# EAGLE design rct_cntrl_brd (EAGLE 8.0.0)
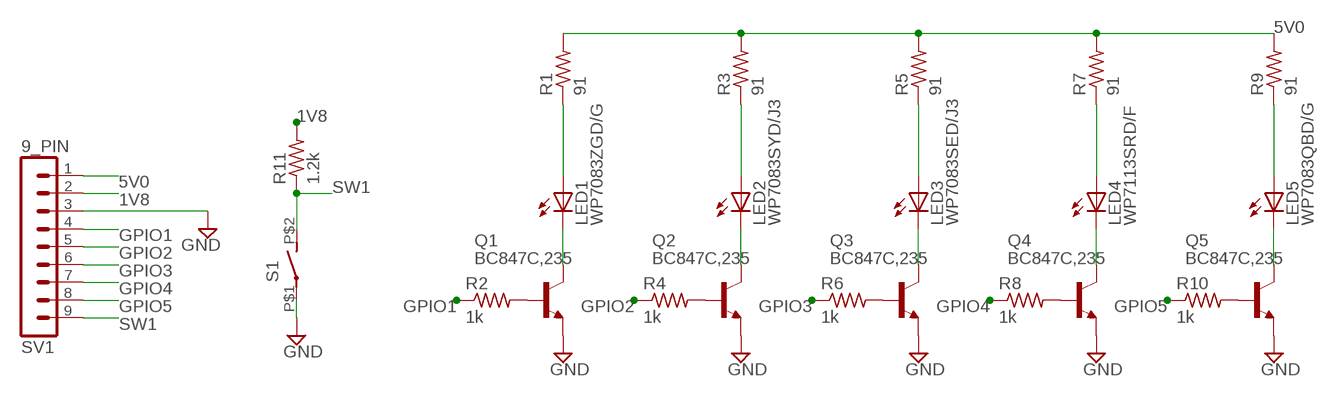
[diagram p0: schematic, sheet 1]

## Parts
LED1  WP7083ZGD/G  LED5MM  [LED5MM]
LED2  WP7083SYD/J3  LED5MM  [LED5MM]
LED3  WP7083SED/J3  LED5MM  [LED5MM]
LED4  WP7113SRD/F  LED5MM  [LED5MM]
LED5  WP7083QBD/G  LED5MM  [LED5MM]
Q1  BC847C,235  BC847C-NPN-SOT23-BEC  [SOT23-BEC]
Q2  BC847C,235  BC847C-NPN-SOT23-BEC  [SOT23-BEC]
Q3  BC847C,235  BC847C-NPN-SOT23-BEC  [SOT23-BEC]
Q4  BC847C,235  BC847C-NPN-SOT23-BEC  [SOT23-BEC]
Q5  BC847C,235  BC847C-NPN-SOT23-BEC  [SOT23-BEC]
R1  91  R-US_R0603  [R0603]
R2  1k  R-US_R0603  [R0603]
R3  91  R-US_R0603  [R0603]
R4  1k  R-US_R0603  [R0603]
R5  91  R-US_R0603  [R0603]
R6  1k  R-US_R0603  [R0603]
R7  91  R-US_R0603  [R0603]
R8  1k  R-US_R0603  [R0603]
R9  91  R-US_R0603  [R0603]
R10  1k  R-US_R0603  [R0603]
R11  1.2k  R-US_R0603  [R0603]
S1  TMS6T5B2M2RE  [PC_THRU_HOLE_2]
SV1  9_PIN  MA09-1  [MA09-1]

## Nets
1V8: R11.2 SV1.2
5V0: R1.2 R3.2 R5.2 R7.2 R9.2 SV1.1
GND: Q1.E Q2.E Q3.E Q4.E Q5.E S1.P$1(P) SV1.3
GPIO1: R2.1 SV1.4
GPIO2: R4.1 SV1.5
GPIO3: R6.1 SV1.6
GPIO4: R8.1 SV1.7
GPIO5: R10.1 SV1.8
N$1: LED3.K(C) Q3.C
N$2: LED1.A R1.1
N$3: LED1.K(C) Q1.C
N$4: Q1.B R2.2
N$5: LED2.A R3.1
N$6: LED2.K(C) Q2.C
N$7: Q2.B R4.2
N$8: LED3.A R5.1
N$9: Q3.B R6.2
N$10: LED4.A R7.1
N$11: LED4.K(C) Q4.C
N$12: Q4.B R8.2
N$13: LED5.A R9.1
N$14: LED5.K(C) Q5.C
N$15: Q5.B R10.2
SW1: R11.1 S1.P$2(S) SV1.9

## Library data of the parts
LED1-LED5 = led:LED: LED OSRAM: - CHIPLED LG R971, LG N971, LY N971, LG Q971, LY Q971, LO R971, LY R971 LH N974, LH R974 LS Q976, LO Q976, LY Q976 LO Q996 - Hyper CHIPLED LW Q18S LB Q993, LB Q99A, LB R99A - SideLED LS A670, LO A670, LY A670, LG A670, LP A670 LB A673, LV A673, LT A673, LW A673 LH A674 LY A675 LS A676, LA A676, LO A676, LY A676, LW A676 LS A679, LY A679, LG A679 - Hyper Micro SIDELED® LS Y876, LA Y876, LO Y876, LY Y876 LT Y87S - SmartLED LW L88C, LW L88S LB L89C, LB L89S, LG L890 LS L89K, LO L89K, LY L89K LS L896, LA L896, LO L896, LY L896 - TOPLED LS T670, LO T670, LY T670, LG T670, LP T670 LSG T670, LSP T670, LSY T670, LOP T670, LYG T670 LG T671, LOG T671, LSG T671 LB T673, LV T673, LT T673, LW T673 LH T674 LS T676, LA T676, LO T676, LY T676, LB T676, LH T676, LSB T676, LW T676 LB T67C, LV T67C, LT T67C, LS T67K, LO T67K, LY T67K, LW E67C LS E67B, LA E67B, LO E67B, LY E67B, LB E67C, LV E67C, LT E67C LW T67C LS T679, LY T679, LG T679 LS T770, LO T770, LY T770, LG T770, LP T770 LB T773, LV T773, LT T773, LW T773 LH T774 LS E675, LA E675, LY E675, LS T675 LS T776, LA T776, LO T776, LY T776, LB T776 LHGB T686 LT T68C, LB T68C - Hyper Mini TOPLED® LB M676 - Mini TOPLED Santana® LG M470 LS M47K, LO M47K, LY M47K Source: http://www.osram.convergy.de LUXEON: - LUMILED® LXK2-PW12-R00, LXK2-PW12-S00, LXK2-PW14-U00, LXK2-PW14-V00 LXK2-PM12-R00, LXK2-PM12-S00, LXK2-PM14-U00 LXK2-PE12-Q00, LXK2-PE12-R00, LXK2-PE12-S00, LXK2-PE14-T00, LXK2-PE14-U00 LXK2-PB12-K00, LXK2-PB12-L00, LXK2-PB12-M00, LXK2-PB14-N00, LXK2-PB14-P00, LXK2-PB14-Q00 LXK2-PR12-L00, LXK2-PR12-M00, LXK2-PR14-Q00, LXK2-PR14-R00 LXK2-PD12-Q00, LXK2-PD12-R00, LXK2-PD12-S00 LXK2-PH12-R00, LXK2-PH12-S00 LXK2-PL12-P00, LXK2-PL12-Q00, LXK2-PL12-R00 Source: www.luxeon.com KINGBRIGHT: KA-3528ASYC Source: www.kingbright.com
Q1-Q5 = transistor:*-NPN-: NPN Transistror BF959 corrected 2008.03.06
R1-R11 = rcl:R-US_: RESISTOR, American symbol
S1 = rct_cntrl_brd:TMS6T5B2M2RE
SV1 = con-lstb:MA09-1: PIN HEADER; OC_FARNELL: unknown; OC_NEWARK: unknown

## Board
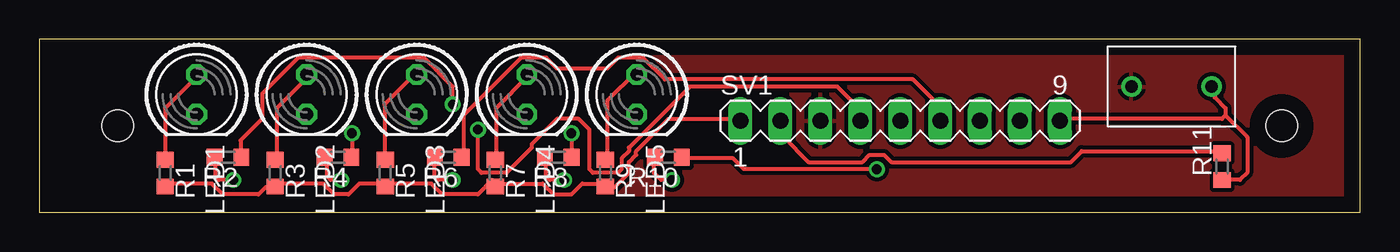
[diagram p1: board, top side]
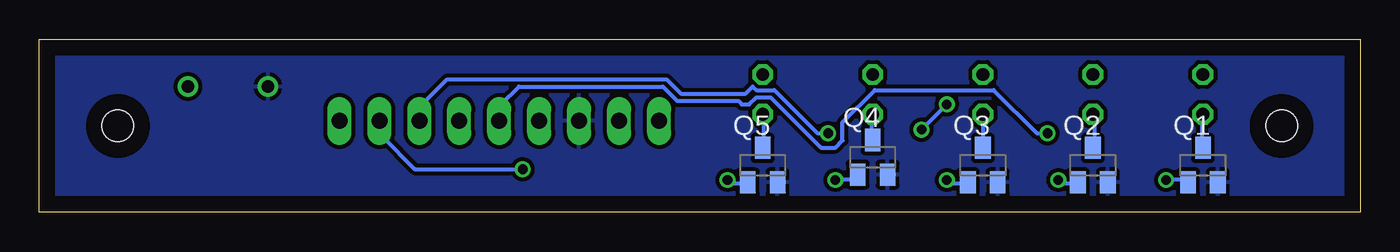
[diagram p2: board, bottom side, seen from below]

Size 84 x 11 mm. Coordinates in mm from the lower left corner, seen from the top.
Outline: 0,0 84,0 84,11 0,11 0,0
Copper layers (1*16): Top 0.035mm / dielectric 1.5mm / Bottom 0.035mm
Design rules "default": minimum track width 10mil, minimum drill 24mil, track to track 8mil, track to pad 8mil, pad to pad 8mil, via to via 8mil, smd to smd 8mil, copper to edge 40mil, drill to drill 8mil, minimum pad ring 10mil, minimum via ring 8mil, stop-mask expansion 4mil, vias tented up to drill 0mil, thermal gap 10mil
Holes 2 mm at 5,5.5 79,5.5

### Footprints (pad centres in the part's own frame; a part is rotated, then mirrored left to right if it is on the bottom)
LED5MM = drill 0.813 octagon: A -1.27,0; K 1.27,0
SOT23-BEC = smd 1 x 1.4: B -0.95,-1.1; C 0,1.1; E 0.95,-1.1
R0603 = smd 1 x 1.1: 1 -0.85,0; 2 0.85,0
PC_THRU_HOLE_2 = drill 0.8: P$1 0,2.54; P$2 0,-2.54
MA09-1 = drill 1.016 long: 1 -10.16,0; 2 -7.62,0; 3 -5.08,0; 4 -2.54,0; 5 0,0; 6 2.54,0; 7 5.08,0; 8 7.62,0; 9 10.16,0

### Placement (x,y rotation side)
LED1  10,7.5 270 top
LED2  17,7.5 270 top
LED3  24,7.5 270 top
LED4  31,7.5 270 top
LED5  38,7.5 270 top
Q1  10,3 0 bottom
Q2  17,3 0 bottom
Q3  24,3 0 bottom
Q4  31,3.5 0 bottom
Q5  38,3 0 bottom
R1  8,2.5 270 top
R2  12,3.5 180 top
R3  15,2.5 270 top
R4  19,3.5 180 top
R5  22,2.5 270 top
R6  26,3.5 180 top
R7  29,2.5 270 top
R8  33,3.5 180 top
R9  36,2.5 270 top
R10  40,3.5 180 top
R11  75.21,2.91 90 top
S1  72,8 90 top
SV1  54.75,5.81 0 top

### Tracks (layer width: path | path; a pad name or v marks a point on that pad's centre or on a via)
1V8
  Top 0.254: R11.2 75.21,3.89 66.29,3.89 65.61,3.2 54.18,3.2 53.72,3.66 52.81,3.66 52.35,3.2 48.92,3.2 47.32,4.8 47.32,5.71 SV1.2
5V0
  Top 0.254: R1.2 8,1.83 10.97,1.83 11.66,1.14 13.95,1.14 14.4,1.6 14.86,1.6 R3.2 15.09,1.83 18.06,1.83 18.75,1.14 19.66,1.14 20.34,1.83 21.95,1.83 R5.2 22.17,1.83 24.92,1.83 25.6,1.14 27.89,1.14 28.8,2.06 29.03,1.83 | 29.03,1.83 32,1.83 32.69,1.14 33.83,1.14 34.52,1.83 35.89,1.83 R9.2 36.12,1.6 36.58,1.6 37.49,2.52 37.49,3.2 37.95,3.66 37.95,3.89 40.01,5.94 44.58,5.94 SV1.1 | 29.03,1.83 R7.2
GND
  pour Bottom (isolate 0.254): 0.5,10.5 83.5,10.5 83.5,0.5 0.5,0.5
  pour Top (isolate 0.254): 0.5,10.5 83.5,10.5 83.5,0.5 0.5,0.5
GPIO1  (via drill 0.61)
  Top 0.254: R2.1 12.8,3.66 12.8,4.57 14.17,5.94 14.17,7.54 16.46,9.83 24.46,9.83 26.29,8 v26.29,6.86 | v27.89,5.26 27.89,2.74 28.12,2.52 29.72,2.52 31.32,4.12 31.32,4.34 32.92,5.94 34.29,5.94 34.98,5.26 34.98,2.74 35.2,2.52 36.8,2.52 37.03,2.74 37.03,3.43 37.49,3.89 37.49,4.12 41.38,8 50.75,8 52.12,6.63 52.12,5.94 SV1.4
  Bottom 0.254: v27.89,5.26 v26.29,6.86
GPIO2  (via drill 0.61)
  Top 0.254: v19.89,5.03 19.89,3.66 R4.1
  Bottom 0.254: v19.89,5.03 20.57,5.03 23.32,7.77 30.86,7.77 32.92,5.71 32.92,4.57 33.38,4.12 34.29,4.12 37.49,7.32 38.41,7.32 38.86,6.86 39.32,6.86 39.55,7.09 43.43,7.09 44.35,8 53.49,8 54.63,6.86 54.63,5.94 SV1.5
GPIO3
  Top 0.254: R6.1 26.98,3.66 26.98,6.17 30.63,9.83 32.23,9.83 32.92,9.14 36.12,9.14 36.8,9.83 38.41,9.83 39.78,8.46 55.55,8.46 57.15,6.86 57.15,5.94 SV1.6
GPIO4  (via drill 0.61)
  Top 0.254: v33.83,5.03 33.83,3.66 R8.1
  Bottom 0.254: v33.83,5.03 34.52,5.03 37.26,7.77 38.41,7.77 38.63,8 39.09,7.54 43.2,7.54 44.12,8.46 58.06,8.46 59.66,6.86 59.66,5.94 SV1.7
GPIO5  (via drill 0.61)
  Top 0.254: v53.26,2.74 44.81,2.74 44.12,3.43 40.92,3.43 R10.1
  Bottom 0.254: v53.26,2.74 60.12,2.74 62.18,4.8 62.18,5.71 SV1.8
N$1
  Bottom 0.254: Q3.C 24,4.12 24,6.17 LED3.K
N$2
  Top 0.254: R1.1 8,3.43 8,6.63 10.06,8.69 LED1.A
N$3
  Bottom 0.254: Q1.C 10.06,4.12 10.06,6.17 LED1.K
N$4  (via drill 0.61)
  Top 0.254: v12.34,2.06 11.43,2.06 11.2,2.29 11.2,3.43 R2.2
  Bottom 0.254: v12.34,2.06 10.97,2.06 Q1.B
N$5
  Top 0.254: R3.1 15.09,3.43 15.09,6.63 17.14,8.69 LED2.A
N$6
  Bottom 0.254: Q2.C 16.92,4.12 16.92,6.17 LED2.K
N$7  (via drill 0.61)
  Top 0.254: v19.2,2.06 18.52,2.06 18.29,2.29 18.29,3.43 R4.2
  Bottom 0.254: v19.2,2.06 18.97,1.83 18.06,1.83 Q2.B
N$8
  Top 0.254: R5.1 21.95,3.43 21.95,6.86 23.55,8.46 23.55,8.69 23.77,8.91 LED3.A
N$9  (via drill 0.61)
  Top 0.254: v26.29,2.06 25.38,2.06 25.15,2.29 25.15,3.43 R6.2
  Bottom 0.254: v26.29,2.06 26.06,1.83 25.15,1.83 Q3.B
N$10
  Top 0.254: R7.1 29.03,3.43 29.03,6.63 31.09,8.69 LED4.A
N$11
  Bottom 0.254: Q4.C 31.09,4.12 31.09,6.17 LED4.K
N$12  (via drill 0.61)
  Top 0.254: v33.38,2.06 32.46,2.06 32.23,2.29 32.23,3.43 R8.2
  Bottom 0.254: v33.38,2.06 32,2.06 Q4.B
N$13
  Top 0.254: R9.1 36.12,3.43 36.12,7.09 37.95,8.91 LED5.A
N$14
  Bottom 0.254: Q5.C 37.95,4.12 37.95,6.17 LED5.K
N$15  (via drill 0.61)
  Top 0.254: v40.23,2.06 39.55,2.06 39.09,2.52 39.09,3.43 R10.2
  Bottom 0.254: v40.23,2.06 40.01,1.83 39.09,1.83 Q5.B
SW1
  Top 0.254: 75.44,6.17 76.81,4.8 76.81,2.52 76.35,2.06 75.44,2.06 R11.1 | 75.44,6.17 75.44,6.63 74.75,7.32 74.75,7.77 S1.P$2 | 75.44,6.17 75.21,5.94 64.92,5.94 SV1.9